# Altium schematic sheet AUDIO.SchDoc: ROBOX V2 - Audio Amplifier
size A4; DrawnBy: Jan Stappers; DocumentNumber: JSP016; Revision: B; SheetNumber: 3; SheetTotal: 6
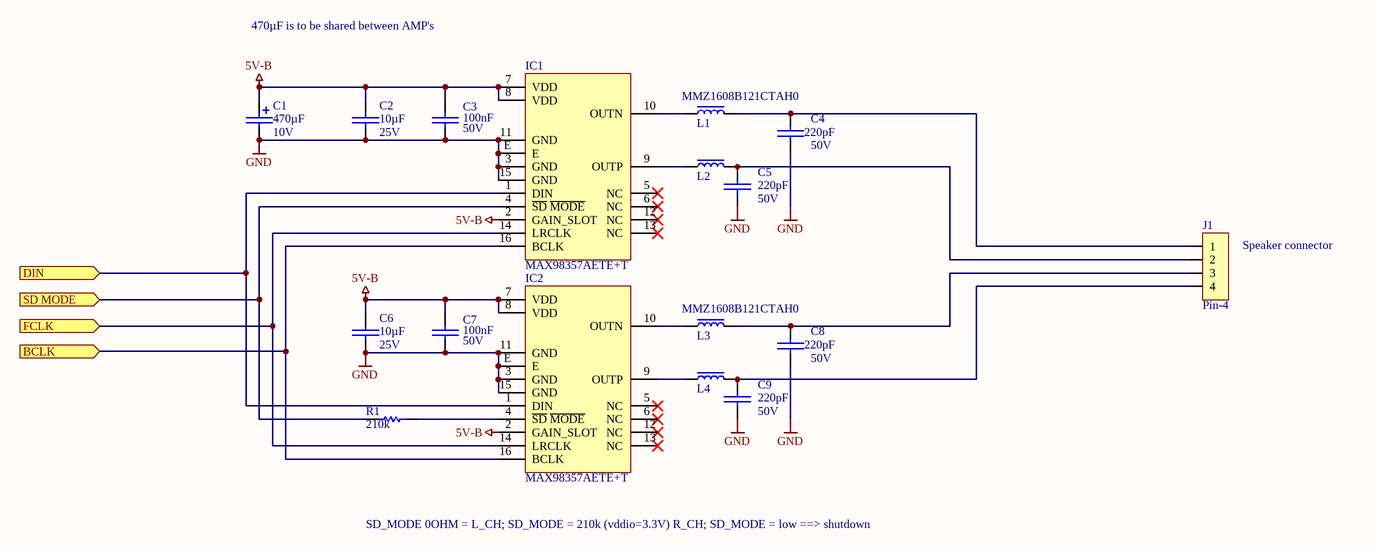
[diagram p0: AUDIO.SchDoc]

## Parts
C1  value 470µF  voltage: 10V  [CD6.3H12TH]  (hidden comment: cap-pol)
C2  value 10µF  voltage: 25V  [C0603]  (hidden comment: cap_non_pol)
C3  value 100nF  voltage: 50V  [C0402]  (hidden comment: cap_non_pol)
C4  value 220pF  voltage: 50V  [TH5.08]  (hidden comment: cap_non_pol)
C5  value 220pF  voltage: 50V  [TH5.08]  (hidden comment: cap_non_pol)
C6  value 10µF  voltage: 25V  [C0603]  (hidden comment: cap_non_pol)
C7  value 100nF  voltage: 50V  [C0402]  (hidden comment: cap_non_pol)
C8  value 220pF  voltage: 50V  [TH5.08]  (hidden comment: cap_non_pol)
C9  value 220pF  voltage: 50V  [TH5.08]  (hidden comment: cap_non_pol)
IC1  MAX98357AETE+T  [TQFN-16]
IC2  MAX98357AETE+T  [TQFN-16]
J1  Pin-4  [110990030]
L1  manufacturer_ref: MMZ1608B121CTAH0  [FB0603]  (hidden comment: ferrite_bead)
L2  ferrite_bead  [FB0603]  (value not drawn)
L3  manufacturer_ref: MMZ1608B121CTAH0  [FB0603]  (hidden comment: ferrite_bead)
L4  ferrite_bead  [FB0603]  (value not drawn)
R1  value 210k  [R0402]  (hidden comment: resistor)

## Ports
BCLK (in), DIN (in), FCLK (in), SD MODE (in)

## Nets
5V-B: C1.+ C2.1 C3.2 C6.1 C7.2 IC1.2(GAIN_SLOT) IC1.7(VDD) IC1.8(VDD) IC2.2(GAIN_SLOT) IC2.7(VDD) IC2.8(VDD)
GND: C1.- C2.2 C3.1 C4.2 C5.2 C6.2 C7.1 C8.2 C9.2 IC1.3(GND) IC1.11(GND) IC1.15(GND) IC1.E IC2.3(GND) IC2.11(GND) IC2.15(GND) IC2.E
BCLK: IC1.16(BCLK) IC2.16(BCLK) ; port BCLK
DIN: IC1.1(DIN) IC2.1(DIN) ; port DIN
FCLK: IC1.14(LRCLK) IC2.14(LRCLK) ; port FCLK
SD MODE: IC1.4(~{SD}_~{MODE}) R1.2 ; port SD MODE
NetC4_1: C4.1 J1.1 L1.2
NetC5_1: C5.1 J1.2 L2.2
NetC8_1: C8.1 J1.3 L3.2
NetC9_1: C9.1 J1.4 L4.2
NetIC1_9: IC1.9(OUTP) L2.1
NetIC1_10: IC1.10(OUTN) L1.1
NetIC2_4: IC2.4(~{SD}_~{MODE}) R1.1
NetIC2_9: IC2.9(OUTP) L4.1
NetIC2_10: IC2.10(OUTN) L3.1

Not connected (* = marked no-connect by the designer): IC1 5(NC)* 6(NC)* 12(NC)* 13(NC)*; IC2 5(NC)* 6(NC)* 12(NC)* 13(NC)*

## Notes on the sheet
- 470µF is to be shared between AMP's
- (near J1) Speaker connector
- SD_MODE 0OHM = L_CH; SD_MODE = 210k (vddio=3.3V) R_CH; SD_MODE = low ==> shutdown
- Title
- Size:
- Date:
- A4
- Number:
- Time:
- Revision:
- Sheet
- of
- File:

## Library data of the parts
C1 = 4: CAP ALUM 470UF 20% 10V TH; manufacturer_ref: EGH1AM471E12OT; manufacturer: AISHI(Aihua Group); id: 4; dielectric: Aluminium; tolerance: 20%; package: d6.3h12TH; supplier_1: lcsc; supplier_1_partnumber: C2924460; price: 0,0391; status: active
C2 C6 = 1: CAP CER 10UF 25V X5R 10% SMD; manufacturer_ref: GRM188R61E106KA73D; manufacturer: Murata Electronics; id: 1; tolerance: 10%; dielectric: X5R; package: 0603; supplier_1: digikey; supplier_1_partnumber: 490-18214-1-ND; price: 0,06969; status: active
C3 C7 = 0: CAP CER 0.1UF 50V X5R 0402; manufacturer_ref: 490-16356-1-ND; manufacturer: Murata Electronics; id: 0; tolerance: 5%; dielectric: X5R; package: 0402; supplier_1: digikey; supplier_1_partnumber: 490-16356-1-ND; price: 0,00933; status: non stock
C4 C5 C8 C9 = 52: CAP CER TH 220pF NP0 50V; manufacturer: WMEC; id: 52; tolerance: 5%; dielectric: X7R; package: TH5.08; supplier_1: lcsc; supplier_1_partnumber: C2761745; price: 0,0237; status: active
IC1 IC2 = 91: IC AMP CLASS D MONO 3.2W 16TQFN; manufacturer: Maxim Integrated; id: 91; manufacturer_ref: MAX98357A; type: Amplifier; package: 16-TQFN; supplier_1: digikey; supplier_1_partnumber: MAX98357AETE+TCT-ND; status: active
J1 = 58: GROVE 2MM 4PIN VERT CONN 10PCS; manufacturer: Seeed Technology Co., Ltd; id: 58; nbr_positions_total: 4; manufacturer_ref: 110990030; package: Pin-4SR; supplier_1: digikey; supplier_1_partnumber: 1597-1082-ND; price: 0,157; status: active
L1 L3 = 4: FERRITE BEAD 120 OHM 0603 1LN; manufacturer: TDK Corporation; id: 4; impedance: 120; dc_resistance: 0.15; current_rating: 0.6A; package: 0603; supplier_1: digikey; supplier_1_partnumber: 445-MMZ1608B121CTAH0CT-ND; price: 0,064; status: active
L2 L4 = 4: FERRITE BEAD 120 OHM 0603 1LN; manufacturer_ref: MMZ1608B121CTAH0; manufacturer: TDK Corporation; id: 4; impedance: 120; dc_resistance: 0.15; current_rating: 0.6A; package: 0603; supplier_1: digikey; supplier_1_partnumber: 445-MMZ1608B121CTAH0CT-ND; price: 0,064; status: active
R1 = 93: RES 210K OHM 1% 1/16W 0402; manufacturer_ref: RC0402FR-07210KL; manufacturer: YAGEO; id: 93; tolerance: 1%; power: 1/16W; package: 0402; supplier_1: digikey; supplier_1_partnumber: 311-210KLRCT-ND; price: 0,014; status: active